# Altium project Low-Voltage-5V-Step-Up-Converter.PrjPcb
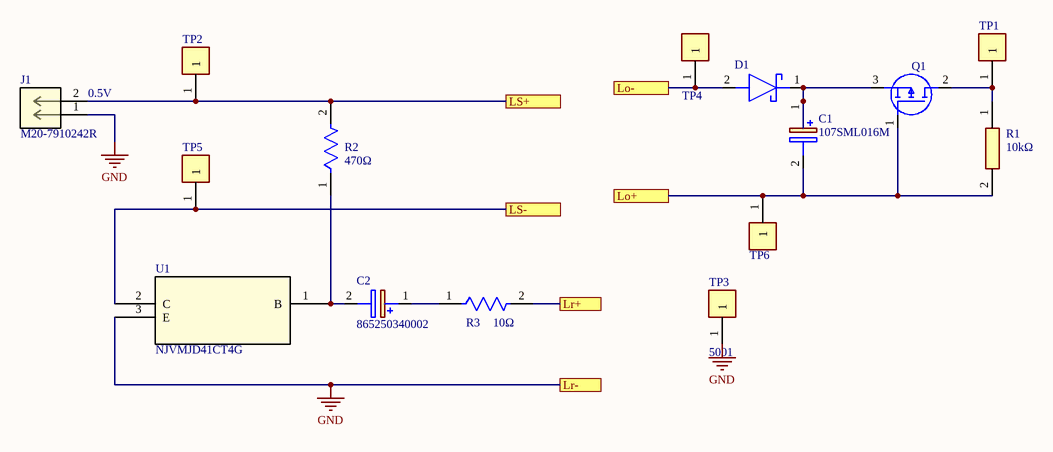
[diagram p0: Low-Voltage-5V-Step-Up-Converter.SchDoc]
1 sheet, 15 parts. Net scope: flat (ports and power ports of the same name join across sheets).
Board file: Low-Voltage-5V-Step-Up-Converter.PcbDoc

## Sheet Low-Voltage-5V-Step-Up-Converter.SchDoc
size A; SheetNumber: 1; SheetTotal: 1

### Parts
C1  107SML016M  [CAPAE660X570N]
C2  865250340002  [CAPAE430X550N]
D1  B2100A-13-F  [DIOM5226X230N]  (value not drawn)
J1  M20-7910242R  [CONN2_910242R_HRW]
Q1  IRF9Z34NSTRLPBF  [IRF2804STRLPBF]  (value not drawn)
R1  Resistance: 10kΩ  [RESC3116X65N]  (hidden comment: RC1206JR-0710KP)
R2  Resistance: 470Ω  [FP-RMCF1206-MFG]  (hidden comment: RMCF1206JT470R)
R3  Resistance: 10Ω  [FP-RNCP0805-IPC_C]  (hidden comment: RNCP0805FTD10R0)
TP1  5001  [FP-5001-MFG]  (value not drawn)
TP2  5001  [FP-5001-MFG]  (value not drawn)
TP3  5001  [FP-5001-MFG]
TP4  5001  [FP-5001-MFG]  (value not drawn)
TP5  5001  [FP-5001-MFG]  (value not drawn)
TP6  5001  [FP-5001-MFG]  (value not drawn)
U1  NJVMJD41CT4G  [DPAK-4_6P22X6P73_ONS]

### Ports
Lo+, Lo-, Lr+, Lr-, LS+, LS-

### Nets
GND: J1.1 TP3.1 U1.3(E) ; port Lr-
NetC1_1: C1.1(+) D1.1(K) Q1.3(S)
NetC1_2: C1.2(-) Q1.1(G) R1.2 TP6.1 ; port Lo+
NetC2_1: C2.1(+) R3.1
NetC2_2: C2.2(-) R2.1 U1.1(B)
NetD1_2: D1.2(A) TP4.1 ; port Lo-
NetJ1_2: J1.2 R2.2 TP2.1 ; port LS+
NetQ1_2: Q1.2(D) R1.1 TP1.1
NetR3_2: R3.2 ; port Lr+
NetTP5_1: TP5.1 U1.2(C) ; port LS-

### Notes on the sheet
- (near J1) 0.5V

### Library data of the parts
C1 = 107SML016M: Capacitor Polarised; Manufacturer_Name: Cornell Dubilier; Datasheet Link: https://www.cde.com/resources/catalogs/SML.pdf; Height: 5.7mm; Manufacturer_Part_Number: 107SML016M; Mouser Part Number: 598-107SML016M; Mouser Price/Stock: https://www.mouser.co.uk/ProductDetail/CDE-Illinois-Capacitor/107SML016M?qs=3tP%252BN51vMXcTATCBEHDSHw%3D%3D
C2 = 865250340002: Capacitor Polarised; Manufacturer_Name: Wurth Elektronik; Datasheet Link: https://componentsearchengine.com/Datasheets/2/865250340002.pdf; Height: 5.5mm; Manufacturer_Part_Number: 865250340002; Mouser Part Number: 710-865250340002; Mouser Price/Stock: https://www.mouser.co.uk/ProductDetail/Wurth-Elektronik/865250340002?qs=0KOYDY2FL298qwYqQV5RgA%3D%3D
D1 = B2100A-13-F: Schottky Diode; Manufacturer_Name: Diodes Inc.; Datasheet Link: https://www.diodes.com/assets/Datasheets/B2100A.pdf; Height: 2.3mm; Manufacturer_Part_Number: B2100A-13-F; Mouser Part Number: 621-B2100A-13-F; Mouser Price/Stock: https://www.mouser.co.uk/ProductDetail/Diodes-Incorporated/B2100A-13-F?qs=nSj%2Fl9JG2%2FrtwU96J2kxXw%3D%3D; Arrow Part Number: B2100A-13-F; Arrow Price/Stock: https://www.arrow.com/en/products/b2100a-13-f/diodes-incorporated?region=nac
J1 = M20-7910242R: No Description Available; Mfr_Name: Harwin; Copyright: Copyright (C) 2023 Ultra Librarian. All rights reserved.; Manufacturer_Part_Number: M20-7910242R; RefDes: RefDes; Type: DEV
Q1 = IRF9Z34NSTRLPBF: MOSFET (P-Channel); Manufacturer_Name: Infineon; Datasheet Link: https://www.infineon.com/dgdl/irf9z34nspbf.pdf?fileId=5546d462533600a40153561228de1de0; Height: 4.83mm; Manufacturer_Part_Number: IRF9Z34NSTRLPBF; Mouser Part Number: 942-IRF9Z34NSTRLPBF; Mouser Price/Stock: https://www.mouser.co.uk/ProductDetail/Infineon-IR/IRF9Z34NSTRLPBF?qs=9%252BKlkBgLFf3iGRjjyBkeug%3D%3D; Arrow Part Number: IRF9Z34NSTRLPBF; Arrow Price/Stock: https://www.arrow.com/en/products/irf9z34nstrlpbf/infineon-technologies-ag?region=nac
R1 = RC1206JR-0710KP: Resistor; Manufacturer_Name: YAGEO; Datasheet Link: https://www.mouser.com/datasheet/2/447/PYu-RC_Group_51_RoHS_L_9-1314892.pdf; Height: 0.65mm; Manufacturer_Part_Number: RC1206JR-0710KP
R2 = CMP-26527-000142-1: 470Ω ±5% 0.25W 1206 Thick Film Chip Resistor AEC-Q200 compliant; Max Power Dissipation: 250mW; Temperature Coefficient: 200ppm/°C; Number of Terminations: 2; Lead Free: Lead Free; Case Code (Imperial): 1206; RoHS Compliant: Yes; Width: 0.063inch; Radiation Hardening: No; Height: 0.028inch; Contact Plating: Tin; Packaging: Tape and Reel; Size Code: 1206; Depth: 1.6mm; Series: RMCF; Min Operating Temperature: -55°C; Max Operating Temperature: 155°C; Military Standard: Not; Length: 3.2mm; Tolerance: 5%; Construction: Rectangular; Mount: Surface Mount; Power Rating: 250mW; Case Code (Metric): 3216; Case/Package: 1206; Resistor Type: Thick Film; Features: Automotive AEC-Q200
R3 = CMP-26527-001729-1: 10Ω ±1% 0.25W 0805 High Power Anti-Sulfur Thin Film Chip Resistor; Temperature Coefficient: 100ppm/°C; Max Power Dissipation: 250mW; Length: 0.079inch; Tolerance: 1%; Series: RNCP; Case Code (Metric): 2012; Packaging: Tape and Reel; Resistor Type: Thin Film; Mount: Surface Mount; Min Operating Temperature: -55°C; Case Code (Imperial): 0805; Height: 0.024inch; Features: Moisture Resistant; RoHS Compliant: Yes; Width: 0.049inch; Max Operating Temperature: 155°C; Case/Package: 0805; Number of Terminations: 2
TP1-TP6 = CMP-2000-05181-2: PC TEST POINT MINIATURE BLACK; Body Material: Bronze; Plating: Silver; Inside Diameter: 1.27mm; Hole Diameter: 1.6mm; Number of Ports: 1; Outside Diameter: 2.54mm; Insulation: Insulated; Insulation Material: Nylon; Mount: Through Hole; RoHS Compliant: Yes; Series: THM; Height: 0.3inch; Termination: Through Hole; Material: Nylon; Packaging: Bulk; Contact Material: Bronze; REACH SVHC: No SVHC; Contact Plating: Silver; Orientation: Straight; Lead Free: Lead Free; Package Quantity: 100; Length: 7.62mm; Flammability Rating: UL94 V-0; Number of Contacts: 1; Diameter: 2.54mm; Housing Color: Black; Color: Black
U1 = NJVMJD41CT4G: No Description Available; Mfr_Name: onsemi; Copyright: Copyright (C) 2023 Ultra Librarian. All rights reserved.; Manufacturer_Part_Number: NJVMJD41CT4G; RefDes: RefDes; Type: DEV